# EAGLE design tiny (EAGLE 9.0.0)
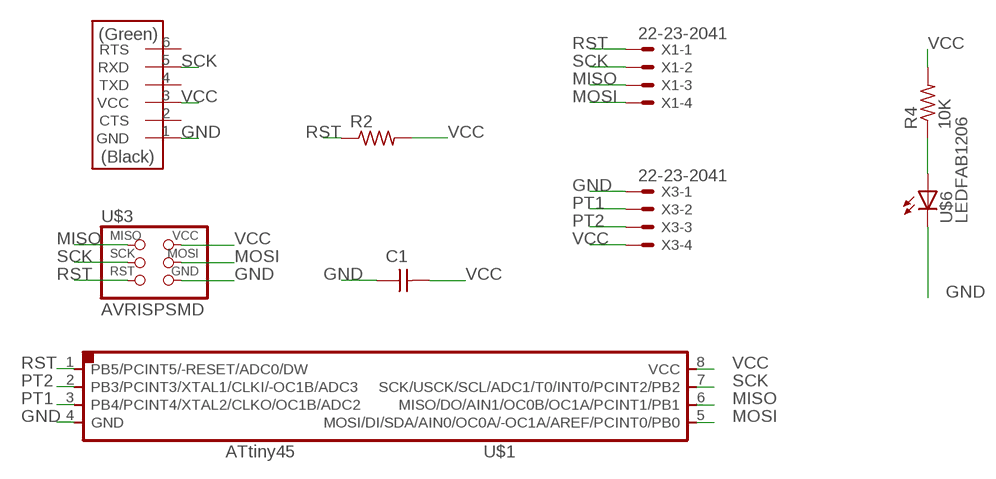
[diagram p0: schematic, sheet 1]

## Parts
C1  CAP-UNPOLARIZEDFAB  [C1206FAB]
R2  RES-US1206FAB  [R1206FAB]
R4  10K  RES-US1206FAB  [R1206FAB]
U$1  ATTINY45SI  [SOIC8]
U$3  AVRISPSMD  [2X03SMD]
U$4  FTDI-SMD-HEADER  [1X06SMD]
U$6  LEDFAB1206  [LED1206FAB]
X1  22-23-2041  [22-23-2041]
X3  22-23-2041  [22-23-2041]

## Nets
GND: C1.1 U$1.4(GND) U$3.6(GND) U$4.1(GND) U$6.2(C) X3.1
MISO: U$1.6(MISO/DO/AIN1/OC0B/OC1A/PCINT1/PB1) U$3.1(MISO) X1.3
MOSI: U$1.5(MOSI/DI/SDA/AIN0/OC0A/-OC1A/AREF/PCINT0/PB0) U$3.4(MOSI) X1.4
PB2: R4.1 U$6.1(A)
PT1: U$1.3(PB4/PCINT4/XTAL2/CLKO/OC1B/ADC2) X3.2
PT2: U$1.2(PB3/PCINT3/XTAL1/CLKI/-OC1B/ADC3) X3.3
RST: R2.1 U$1.1(PB5/PCINT5/-RESET/ADC0/DW) U$3.5(RST) X1.1
SCK: U$1.7(SCK/USCK/SCL/ADC1/T0/INT0/PCINT2/PB2) U$3.3(SCK) U$4.5(RXD) X1.2
VCC: C1.2 R2.2 R4.2 U$1.8(VCC) U$3.2(VCC) U$4.3(VCC) X3.4
Unconnected: U$4.2(CTS) U$4.4(TXD) U$4.6(RTS)

## Library data of the parts
C1 = fab:CAP-UNPOLARIZED
R2 R4 = fab:RES-US: Resistor (US Symbol) Variants with postfix FAB are widened to allow the routing of internal traces
U$1 = fab:ATTINY45
U$3 = fab:AVRISP
U$4 = fab:FTDI-SMD-HEADER
U$6 = fab:LED: LED
X1 X3 = con-molex:22-23-2041: .100" (2.54mm) Center Header - 4 Pin; MF: MOLEX; MPN: 22-23-2041; OC_FARNELL: 1462920; OC_NEWARK: 38C0355

## Board
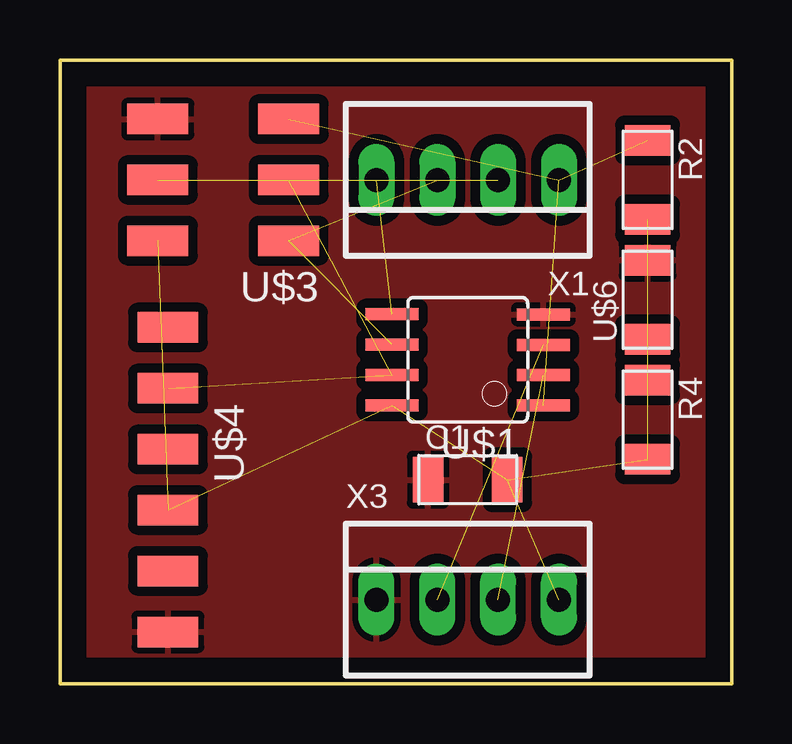
[diagram p1: board, top side]

Size 28 x 26 mm. Coordinates in mm from the lower left corner, seen from the top.
Outline: 0,0 0,26 28,26 28,0 0,0
Copper layers (1*16): Top 0.035mm / dielectric 1.5mm / Bottom 0.035mm
Design rules "default *": minimum track width 0.3mm, minimum drill 0.4mm, track to track 0.4mm, track to pad 0.4mm, pad to pad 0.4mm, via to via 0.4mm, smd to smd 0.4mm, copper to edge 40mil, drill to drill 6mil, minimum pad ring 10mil, minimum via ring 8mil, stop-mask expansion 4mil, vias tented up to drill 0mil, thermal gap 10mil

### Footprints (pad centres in the part's own frame; a part is rotated, then mirrored left to right if it is on the bottom)
C1206FAB = smd 1.27 x 1.905: 1 -1.651,0; 2 1.651,0
R1206FAB = smd 1.27 x 1.905: 1 -1.651,0; 2 1.651,0
SOIC8 = smd 0.5 x 2.2: 1 -1.905,-3.154; 2 -0.645,-3.154; 3 0.625,-3.154; 4 1.895,-3.154; 5 1.905,3.154; 6 0.635,3.154; 7 -0.635,3.154; 8 -1.905,3.154
2X03SMD = smd 2.54 x 1.27: 1 -2.54,2.54; 2 2.92,2.54; 3 -2.54,0; 4 2.92,0; 5 -2.54,-2.54; 6 2.92,-2.54
1X06SMD = smd 2.54 x 1.27: 1 0,6.35; 2 0,3.81; 3 0,1.27; 4 0,-1.27; 5 0,-3.81; 6 0,-6.35
LED1206FAB = smd 1.27 x 1.905: 1 -1.651,0; 2 1.651,0
22-23-2041 = drill 1 long: 1 -3.81,0; 2 -1.27,0; 3 1.27,0; 4 3.81,0

### Placement (x,y rotation side)
C1  17,8.5 0 top
R2  24.5,21 270 top
R4  24.5,11 270 top
U$1  17,13.5 90 top
U$3  7,21 180 top
U$4  4.5,8.5 180 top
U$6  24.5,16 90 top
X1  17,21 180 top
X3  17,3.5 0 top

### Tracks (layer width: path | path; a pad name or v marks a point on that pad's centre or on a via)
GND
  pour Top: -1,27 29,27 29,-1 -1,-1
MISO  (2 unrouted)
MOSI  (2 unrouted)
PB2  (1 unrouted)
PT1  (1 unrouted)
PT2  (1 unrouted)
RST  (3 unrouted)
SCK  (3 unrouted)
VCC  (6 unrouted)